# EAGLE design laserTarget (EAGLE 6.5.0)
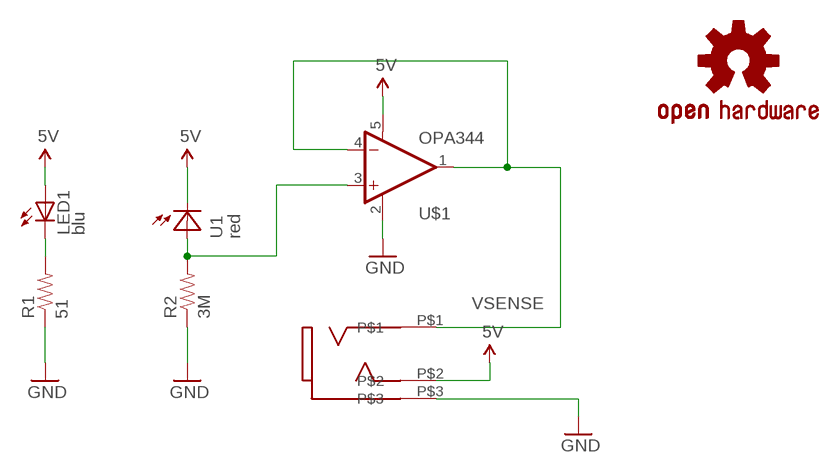
[diagram p0: schematic, sheet 1]

## Parts
LED1  blu  LED5MM  [LED5MM]
LOGO1  OSHW-LOGOS  [OSHW-LOGO-S]
R1  51  RESISTOR0805-RES  [0805]
R2  3M  RESISTOR0805-RES  [0805]
U1  red  CLS15CLS15  [CLS15]
U$1  OPA344  [SOT23-5]
U$2  35RASMT2BHNTRX  [35RASMT2BHNTRX]

## Nets
5V: LED1.A U1.3(C) U1.4(C) U$1.5(V+) U$2.P$2
GND: R1.1 R2.1 U$1.2(V-) U$2.P$3
N$1: R2.2 U1.1(A) U1.2(A) U$1.3(+IN)
N$2: LED1.K(C) R1.2
VSENSE: U$1.1(OUT) U$1.4(-IN) U$2.P$1

## Library data of the parts
LED1 = SparkFun-LED:LED: LEDs Standard schematic elements and footprints for 5mm, 3mm, 1206, and 0603 sized LEDs. 5mm - Spark Fun Electronics SKU : COM-00529 (and others)
LOGO1 = SparkFun-Aesthetics:OSHW-LOGO: Open Source Hardware Logo This logo indicates the piece of hardware it is found on incorporates a OSHW license and/or adheres to the definition of open source hardware found here: http://freedomdefined.org/OSHW
R1 R2 = SparkFun-Passives:RESISTOR: Resistor Basic schematic elements and footprints for 0603, 1206, and PTH resistors.
U1 = torpedo:CLS15
U$1 = SparkFun-AnalogIC:OPA344: Single gate rail-to-rail output op-amp. Inputs extend 300mV past rails.
U$2 = alvarop-lib:35RASMT2BHNTRX

## Board
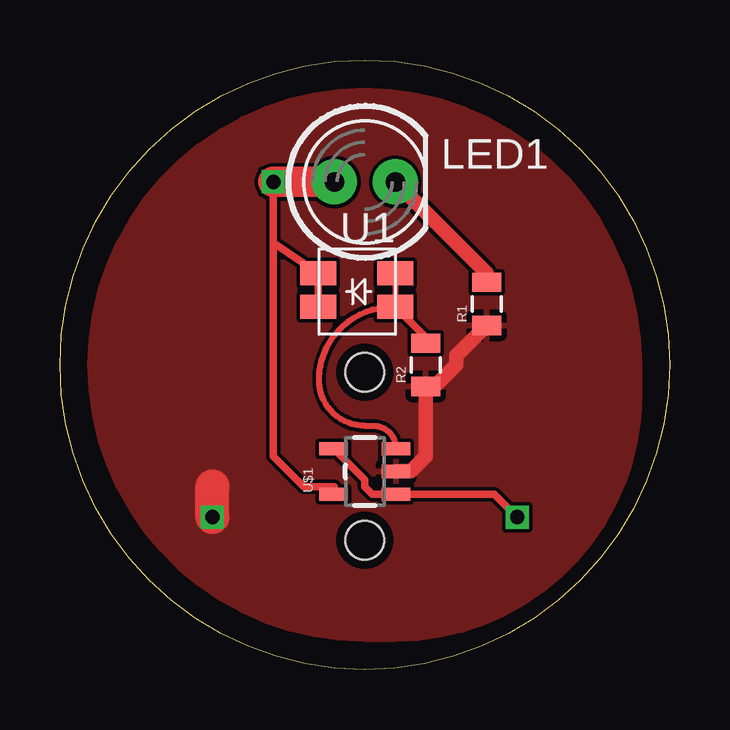
[diagram p1: board, top side]
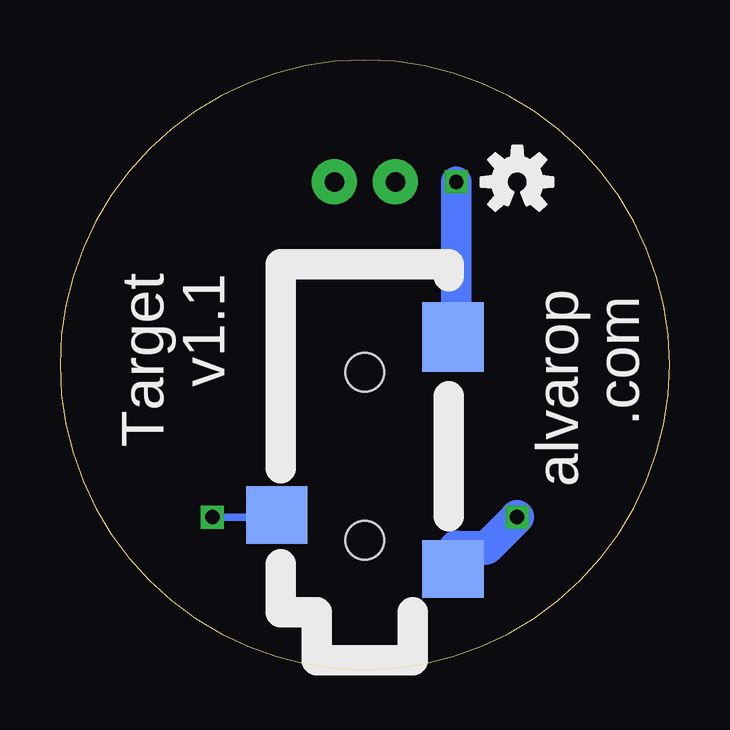
[diagram p2: board, bottom side, seen from below]

Size 25.4 x 25.4 mm. Coordinates in mm from the lower left corner, seen from the top.
Outline: 25.4,12.7 arc-180 0,12.7 arc-180 25.4,12.7
Copper layers (1*16): Top 0.0356mm / dielectric 1.5011mm / Bottom 0.0356mm
Design rules "LaenPCBOrder": minimum track width 6mil, minimum drill 13mil, track to track 6mil, track to pad 6mil, pad to pad 6mil, via to via 6mil, smd to smd 6mil, copper to edge 15mil, drill to drill 6mil, minimum pad ring 7mil, minimum via ring 7mil, stop-mask expansion 3mil, vias tented up to drill 0mil, thermal gap 10mil

### Footprints (pad centres in the part's own frame; a part is rotated, then mirrored left to right if it is on the bottom)
LED5MM = drill 0.813 pad 1.88: A -1.27,0; K 1.27,0
0805 = smd 0.8 x 1.2: 1 -0.9,0; 2 0.9,0
CLS15 = smd 1.5 x 1: 1 0,0; 2 0,1.4; 3 3.2,1.4; 4 3.2,0
SOT23-5 = smd 0.55 x 1.2: 1 -0.95,-1.3; 2 0,-1.3; 3 0.95,-1.3; 4 0.95,1.3; 5 -0.95,1.3
35RASMT2BHNTRX = smd 2.4 x 2.55: P$1 -2.44,3.675; P$3 -4.7,-3.675 | smd 2.9 x 2.55: P$2 4.96,-3.675 | hole 1.6: -3.5,0; 3.5,0

### Placement (x,y rotation side)
LED1  12.7,20.32 0 top
LOGO1  6.35,20.32 0 bottom
R1  17.78,15.24 90 top
R2  15.24,12.7 90 top
U1  13.97,16.51 180 top
U$1  12.7,8.26 90 top
U$2  12.7,8.89 90 bottom

### Tracks (layer width: path | path; a pad name or v marks a point on that pad's centre or on a via)
5V  (via drill 0.6)
  Top 0.305: 8.89,17.78 U1.4 U1.3 | 8.89,17.78 v8.89,20.32 | U$1.5 11.43,7.62 10.16,7.62 8.89,8.89 8.89,17.78
  Top 1.27: v8.89,20.32 LED1.A
  Bottom 1.27: U$2.P$2 8.89,13.85 v8.89,20.32
GND  (via drill 0.6)
  Top 0.305: 15.61,11.8 R2.1
  Top 0.61: R1.1 16.51,13.07 16.51,12.7 15.61,11.8 | R2.1 15.24,8.89 14.61,8.26 U$1.2
  Top 1.422: v6.35,6.35 6.35,7.62
  Bottom 0.406: U$2.P$3 8.89,4.19 8.89,5.08
  Bottom 1.422: 8.89,5.08 7.62,5.08 v6.35,6.35
  pour Top: 12.7,24.13 arc-90 24.13,12.7 24.13,11.43 arc-90 13.97,1.27 12.7,1.27 arc-90 1.27,12.7 arc-90
N$1
  Top 0.254: U1.1 U1.2 13.84,15.11 arc90 10.79,12.06 arc90 12.7,10.16 13.04,10.16 arc-90 U$1.3
  Top 0.305: U1.2 15.24,13.84 R2.2
N$2
  Top 0.305: 17.78,16.51 R1.2
  Top 0.61: LED1.K 17.78,16.51
VSENSE  (via drill 0.6)
  Top 0.305: U$1.4 12.7,7.91 12.7,7.62 13.02,7.3 U$1.1 18.09,7.3 v19.05,6.35
  Bottom 0.305: v19.05,6.35 16.48,6.35 U$2.P$1

### Text on the board
bNames: v1.1 | Target | .com | alvarop